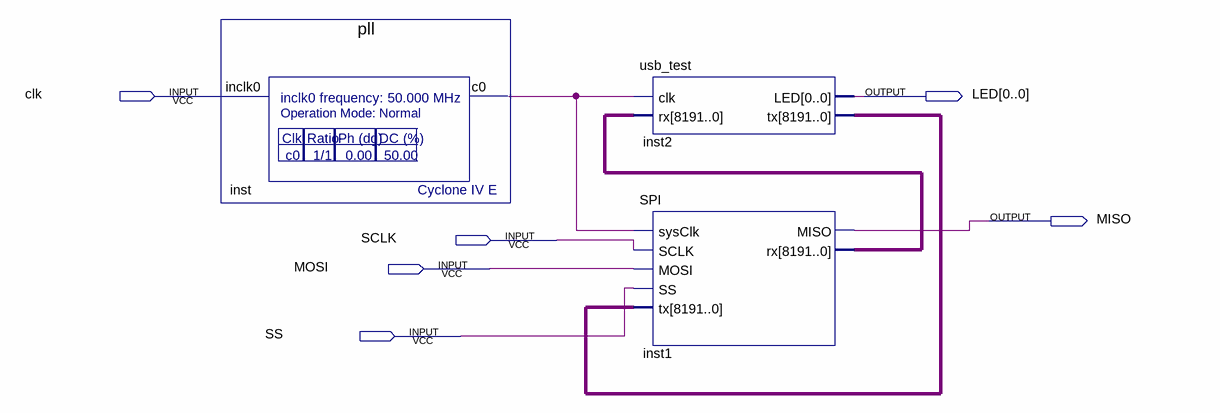
[diagram p0: schematic sheet]
// Quartus schematic usb_test2.bdf as structural Verilog: 3 symbols, 6 pins
module usb_test2 (
  input  clk,
  input  SCLK,
  input  MOSI,
  input  SS,
  output [0:0] LED,
  output MISO
);

  wire inst1_rx_8191__0_, inst2_tx_8191__0_, inst_c0;

  pll inst (.inclk0(clk), .c0(inst_c0));
  usb_test inst2 (.clk(inst_c0), .\rx[8191..0] (inst1_rx_8191__0_), .LED(LED[0]), .\tx[8191..0] (inst2_tx_8191__0_));
  SPI inst1 (
    .sysClk(inst_c0), .SCLK(SCLK), .MOSI(MOSI), .SS(SS), .\tx[8191..0] (inst2_tx_8191__0_), .MISO(MISO),
    .\rx[8191..0] (inst1_rx_8191__0_));
endmodule
